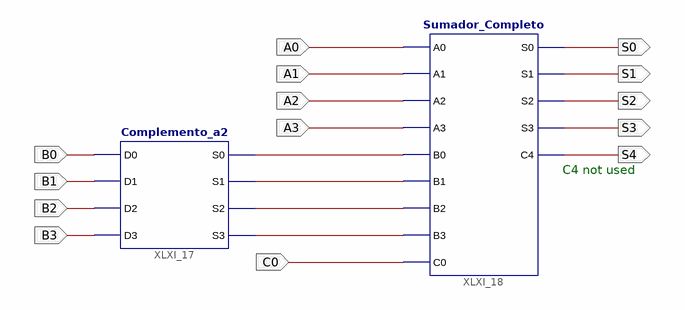
[diagram p0: schematic sheet 1]
// Xilinx ISE schematic Restador.sch (spartan6) as structural Verilog: 2 symbols, 14 ports
module Restador (
  input  B0,
  input  B1,
  input  B2,
  input  B3,
  input  C0,
  input  A0,
  input  A1,
  input  A2,
  input  A3,
  output S0,
  output S1,
  output S2,
  output S3,
  output S4
);

  wire XLXN_114, XLXN_115, XLXN_116, XLXN_117;

  Complemento_a2 XLXI_17 (
    .D0(B0), .D1(B1), .D2(B2), .D3(B3), .S0(XLXN_114), .S1(XLXN_115), .S2(XLXN_116), .S3(XLXN_117));
  Sumador_Completo XLXI_18 (
    .A0(A0), .A1(A1), .A2(A2), .A3(A3), .B0(XLXN_114), .B1(XLXN_115), .B2(XLXN_116), .B3(XLXN_117), .C0(C0),
    .C4(S4), .S0(S0), .S1(S1), .S2(S2), .S3(S3));

  // Notes on the sheet:
  //   C4 not used
endmodule
